# Altium schematic sheet [03] - 28Pins Schematic.SchDoc (part 2 of 3)
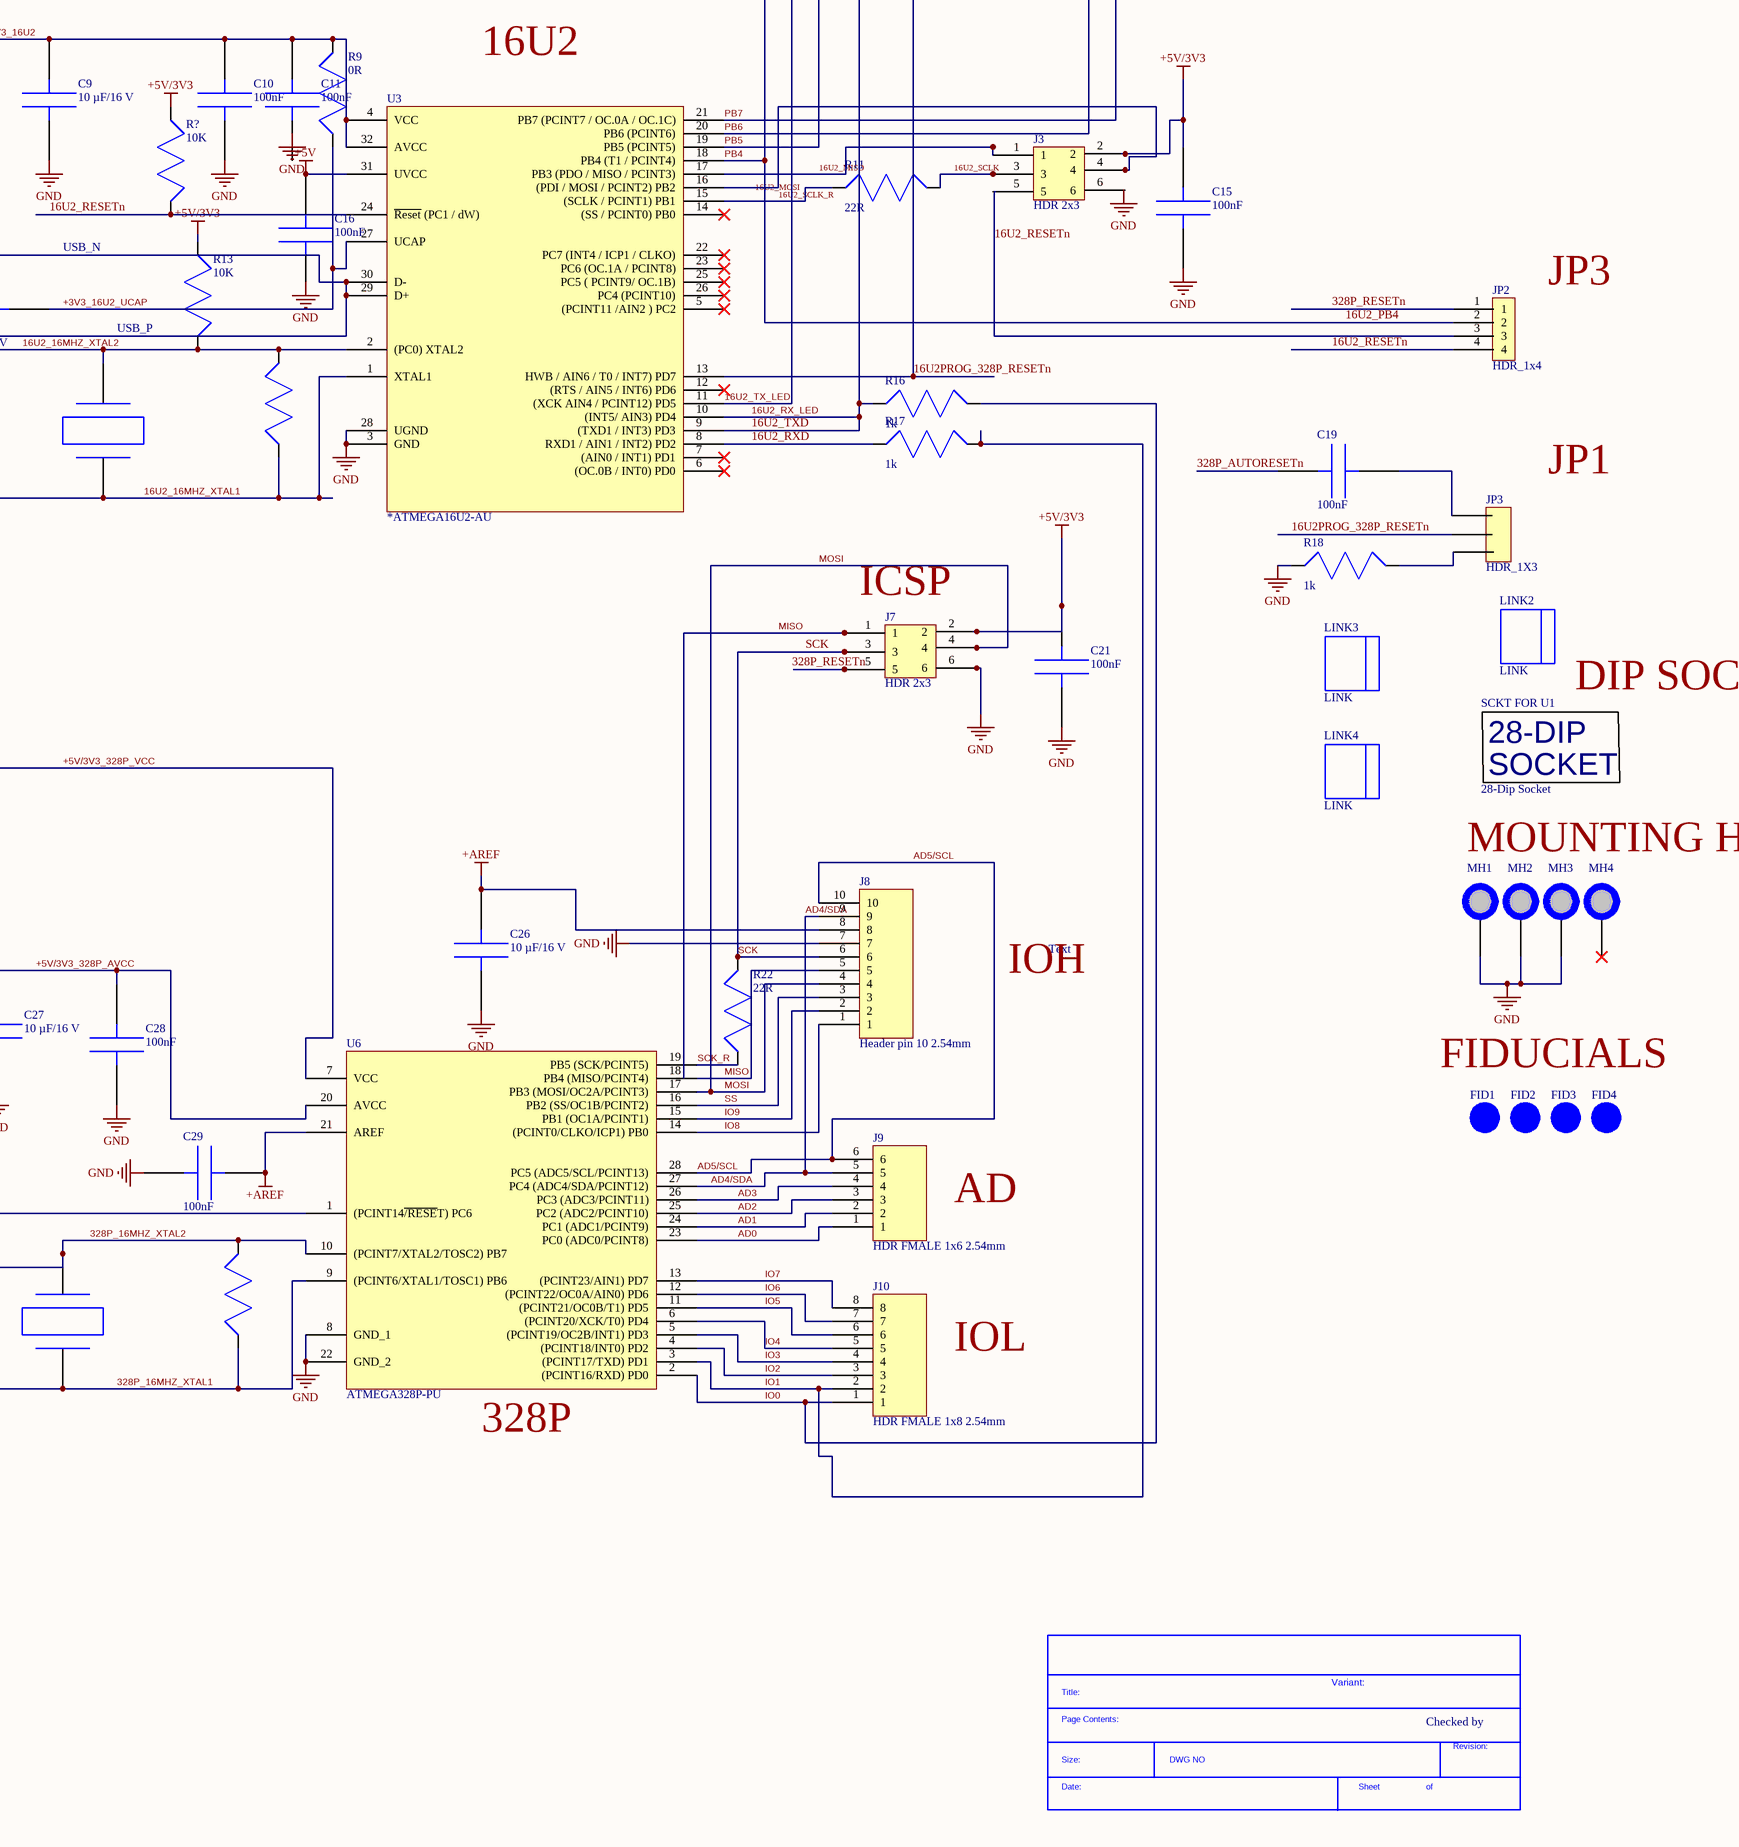
[diagram p4: [03] - 28Pins Schematic.SchDoc, bottom right]
## Library data of the parts
1 1M = R?: Res Thick Film 0805 1M Ohm 1% 0.125W(1/8W) ±100ppm/C Pad SMD T/R; Manufacturer: Yageo Phycomp; Manufacturer Part Number: RC0805FR-071ML; Power Rating: 125mW; Temperature Coefficient: 100ppm/°C; Resistance: 1MR; Voltage Rating (DC): 150V; Supplier 1: Digi-Key; Supplier Part Number 1: 311-1.00MCRCT-ND; RoHS: Yes; Category: Chip SMD Resistors; Stock 1: 588555; Pricing 1: 1=0.10000, 10=0.04200, 100=0.01690, 1000=0.00759, 2500=0.00659 (USD); Mount: Surface Mount; Case/Package: 0805; Number of Pins: 2; Min Operating Temperature: -55°C; Max Operating Temperature: 155°C; Tolerance: 1%; Packaging: Cut Tape; Length: 2mm; Width: 1.25mm; Height: 0.5mm; Depth: 1.25mm; REACH SVHC: No SVHC; Lead Free: Lead Free; ComponentLink1URL: http://www.mouser.com/ds/2/447/Yageo_08112016_RC0805-968729.pdf?src-supplier=Mouser; ComponentLink1Description: http://www.mouser.com/ds/2/447/Yageo_08112016_RC0805-968729.pdf?src-supplier=Mouser; ComponentLink2URL: http://www.farnell.com/datasheets/2167052.pdf?src-supplier=Farnell; ComponentLink2Description: http://www.farnell.com/datasheets/2167052.pdf?src-supplier=Farnell; ComponentLink3URL: http://www.yageo.com/documents/recent/PYu-RC_Group_51_RoHS_L_10.pdf?src-supplier=Digi-Key; ComponentLink3Description: http://www.yageo.com/documents/recent/PYu-RC_Group_51_RoHS_L_10.pdf?src-supplier=Digi-Key; ComponentLink4URL: http://www.farnell.com/datasheets/2167052.pdf?src-supplier=Newark; ComponentLink4Description: http://www.farnell.com/datasheets/2167052.pdf?src-supplier=Newark; ComponentLink5URL: http://www.farnell.com/datasheets/444164.pdf?src-supplier=Element14; ComponentLink5Description: http://www.farnell.com/datasheets/444164.pdf?src-supplier=Element14
C1 C2 C5-C7 C10 C11 C14-C16 C19 C21 C22 C24 C25 C28-C30 C33 = C2012X7R1H104K085AA: TDK - C2012X7R1H104K085AA - SMD Multilayer Ceramic Capacitor, 0.1 µF, 50 V, 0805 [2012 Metric], ± 10%, X7R, C Series; Voltage Rating: 50V; Supplier 1: Digi-Key; Supplier Part Number 1: 445-7534-1-ND; Manufacturer: TDK; Manufacturer Part Number: C2012X7R1H104K085AA; RoHS: Yes; Category: Ceramic Capacitors; Stock 1: 381078; Pricing 1: 1=0.15000, 10=0.10900, 50=0.06160, 100=0.05100, 500=0.03578, 1000=0.02962 (USD); Mount: Surface Mount; Case/Package: 0805; Number of Pins: 2; Case Code (Metric): 2012; Case Code (Imperial): 0805; Weight: 0.000194oz; Dielectric Material: Ceramic; Min Operating Temperature: -55°C; Max Operating Temperature: 125°C; Capacitance: 100nF; Tolerance: 10%; Dielectric: X7R; Packaging: Tape and Reel; Voltage Rating (DC): 50V; Termination: SMD/SMT; Construction: Flat; Package Quantity: 1; Resistor Type: Ceramic; Voltage: 50V; Series: C; Length: 2mm; Width: 0.049inch; Height: 0.85mm; Depth: 1.25mm; Thickness: 0.037inch; Radiation Hardening: No; RoHS Compliant: Yes; REACH SVHC: No SVHC; Lead Free: Lead Free; ComponentLink1URL: https://datasheet.ciiva.com/11788/0900766b80c1bb00-11788128.pdf?src-supplier=RSComponents; ComponentLink1Description: https://datasheet.ciiva.com/11788/0900766b80c1bb00-11788128.pdf?src-supplier=RSComponents; ComponentLink2URL: https://datasheet.ciiva.com/6250/tdkmlcccaprange-6250821.pdf?src-supplier=Digi-Key; ComponentLink2Description: https://datasheet.ciiva.com/6250/tdkmlcccaprange-6250821.pdf?src-supplier=Digi-Key; ComponentLink3URL: https://datasheet.ciiva.com/6250/tdkmlcccaprange-6250824.pdf?src-supplier=Digi-Key; ComponentLink3Description: https://datasheet.ciiva.com/6250/tdkmlcccaprange-6250824.pdf?src-supplier=Digi-Key; ComponentLink4URL: https://datasheet.ciiva.com/24191/e412-c-24191447.pdf?src-supplier=Future+Electronics; ComponentLink4Description: https://datasheet.ciiva.com/24191/e412-c-24191447.pdf?src-supplier=Future+Electronics; ComponentLink5URL: https://datasheet.ciiva.com/23803/1796654-23803035.pdf?src-supplier=Newark; ComponentLink5Description: https://datasheet.ciiva.com/23803/1796654-23803035.pdf?src-supplier=Newark; ComponentLink6URL: https://datasheet.ciiva.com/28602/1571323-28602204.pdf?src-supplier=Element14; ComponentLink6Description: https://datasheet.ciiva.com/28602/1571323-28602204.pdf?src-supplier=Element14
C3 C4 C8 C9 C23 C26 C27 = C2012X5R1C106M085AC: TDK - C2012X5R1C106M085AC - SMD Multilayer Ceramic Capacitor, 10 µF, 16 V, 0805 [2012 Metric], ± 20%, X5R, C Series TDK; Capacitance: 10uF; Voltage Rating: 16V; Supplier 1: Digi-Key; Supplier Part Number 1: 445-7645-1-ND; Manufacturer: TDK; Manufacturer Part Number: C2012X5R1C106M085AC; RoHS: Yes; Category: Ceramic Capacitors; Stock 1: 117974; Pricing 1: 1=0.29000, 10=0.19800, 50=0.11900, 100=0.10050, 500=0.06876, 1000=0.06084 (USD); Mount: Surface Mount; Case/Package: 0805; Number of Pins: 2; Case Code (Metric): 2012; Case Code (Imperial): 0805; Weight: 0.000194oz; Dielectric Material: Ceramic; Min Operating Temperature: -55°C; Max Operating Temperature: 85°C; Packaging: Tape and Reel; Tolerance: 20%; Termination: SMD/SMT; Package Quantity: 4000; Voltage Rating (DC): 16V; Dielectric: X5R; Resistor Type: Ceramic; Series: C; Construction: Flat; Voltage: 16V; Length: 2mm; Width: 0.049inch; Height: 0.85mm; Thickness: 0.037inch; Depth: 1.25mm; REACH SVHC: No SVHC; Lead Free: Lead Free; ComponentLink1URL: https://datasheet.ciiva.com/24218/c2012x5r1c106m085ac-265002-24218340.pdf?src-supplier=Mouser; ComponentLink1Description: https://datasheet.ciiva.com/24218/c2012x5r1c106m085ac-265002-24218340.pdf?src-supplier=Mouser; ComponentLink2URL: https://datasheet.ciiva.com/11788/0900766b80c1bb00-11788108.pdf?src-supplier=RSComponents; ComponentLink2Description: https://datasheet.ciiva.com/11788/0900766b80c1bb00-11788108.pdf?src-supplier=RSComponents; ComponentLink3URL: https://datasheet.ciiva.com/6290/tdkmlcccaprange-6290487.pdf?src-supplier=Digi-Key; ComponentLink3Description: https://datasheet.ciiva.com/6290/tdkmlcccaprange-6290487.pdf?src-supplier=Digi-Key; ComponentLink4URL: https://datasheet.ciiva.com/6290/tdkmlcccaprange-6290485.pdf?src-supplier=Digi-Key; ComponentLink4Description: https://datasheet.ciiva.com/6290/tdkmlcccaprange-6290485.pdf?src-supplier=Digi-Key; ComponentLink5URL: https://datasheet.ciiva.com/16449/e412-c-16449591.pdf?src-supplier=Future+Electronics; ComponentLink5Description: https://datasheet.ciiva.com/16449/e412-c-16449591.pdf?src-supplier=Future+Electronics; ComponentLink6URL: https://datasheet.ciiva.com/22725/1913358-22725557.pdf?src-supplier=Element14; ComponentLink6Description: https://datasheet.ciiva.com/22725/1913358-22725557.pdf?src-supplier=Element14; ComponentLink7URL: https://datasheet.ciiva.com/23803/1796654-23803021.pdf?src-supplier=Newark; ComponentLink7Description: https://datasheet.ciiva.com/23803/1796654-23803021.pdf?src-supplier=Newark
C12 C13 = EEE-1AA101WR: Cap Aluminum 100uF 10V 20% (5 X 5.4mm) SMD 50mA 1000 hr 85°C T/R; Manufacturer: Panasonic; Life (Hours): 1000Hour; Supplier 1: RSComponents; Supplier Part Number 1: 1763738; Manufacturer Part Number: EEE-1AA101WR; RoHS: Yes; Category: Aluminum Electrolytic Capacitors; Stock 1: 1; Pricing 1: 1000=0.08000, 3000=0.07600 (USD); Mount: Surface Mount,PCB; Case/Package: Radial; Contact Plating: Tin; Min Operating Temperature: -40°C; Max Operating Temperature: 85°C; Capacitance: 100uF; Tolerance: 20%; Ripple Current: 50mA; Voltage Rating: 10V; Packaging: Tape and Reel; Package Quantity: 1; Voltage Rating (DC): 10V; Termination: SMD/SMT; Ripple Current (AC): 50mA; Series: S; Construction: Cylindrical; Diameter: 5mm; Length: 5.5mm; Height: 5.4mm; Height - Seated (Max): 0.213inch; Radiation Hardening: No; Lead Free: Lead Free; RoHS Compliant: Yes; REACH SVHC: Unknown; ComponentLink1URL: https://datasheet.ciiva.com/26945/getdatasheetpartid-169213-26945071.pdf?src-supplier=Verical; ComponentLink1Description: https://datasheet.ciiva.com/26945/getdatasheetpartid-169213-26945071.pdf?src-supplier=Verical; ComponentLink2URL: https://datasheet.ciiva.com/24027/aba0000ce2-40801-24027541.pdf?src-supplier=Mouser; ComponentLink2Description: https://datasheet.ciiva.com/24027/aba0000ce2-40801-24027541.pdf?src-supplier=Mouser; ComponentLink3URL: https://datasheet.ciiva.com/14598/70255710-14598233.pdf?src-supplier=Allied+Electronics; ComponentLink3Description: https://datasheet.ciiva.com/14598/70255710-14598233.pdf?src-supplier=Allied+Electronics; ComponentLink4URL: https://datasheet.ciiva.com/14605/70255710-14605689.pdf?src-supplier=Allied+Electronics; ComponentLink4Description: https://datasheet.ciiva.com/14605/70255710-14605689.pdf?src-supplier=Allied+Electronics; ComponentLink5URL: https://datasheet.ciiva.com/11673/aba0000ce2-11673882.pdf?src-supplier=Avnet; ComponentLink5Description: https://datasheet.ciiva.com/11673/aba0000ce2-11673882.pdf?src-supplier=Avnet; ComponentLink6URL: https://datasheet.ciiva.com/16427/aba0000ce2-16427544.pdf?src-supplier=Future+Electronics; ComponentLink6Description: https://datasheet.ciiva.com/16427/aba0000ce2-16427544.pdf?src-supplier=Future+Electronics; ComponentLink7URL: https://datasheet.ciiva.com/2983/aba0000ce2-2983906.pdf?src-supplier=Avnet; ComponentLink7Description: https://datasheet.ciiva.com/2983/aba0000ce2-2983906.pdf?src-supplier=Avnet; ComponentLink8URL: https://datasheet.ciiva.com/30075/11aba0000ce2-30075303.pdf?src-supplier=Onlinecomponents.com; ComponentLink8Description: https://datasheet.ciiva.com/30075/11aba0000ce2-30075303.pdf?src-supplier=Onlinecomponents.com
C17 = C2012X5R1E105K125AA: TDK - C2012X5R1E105K125AA - SMD Multilayer Ceramic Capacitor, 1 µF, 25 V, 0805 [2012 Metric], ± 10%, X5R, C Series; Capacitance: 1uF; Voltage Rating: 25V; Supplier 1: Digi-Key; Supplier Part Number 1: 445-1419-1-ND; Manufacturer: TDK; Manufacturer Part Number: C2012X5R1E105K125AA; RoHS: Yes; Category: Ceramic Capacitors; Stock 1: 297; Pricing 1: 1=0.23000, 10=0.15800, 50=0.09500, 100=0.08030, 500=0.05492, 1000=0.04858 (USD); Mount: Surface Mount; Case/Package: 0805; Number of Pins: 2; Case Code (Metric): 2012; Case Code (Imperial): 0805; Dielectric Material: Ceramic; Weight: 0.000194oz; Min Operating Temperature: -55°C; Max Operating Temperature: 85°C; Tolerance: 10%; Packaging: Tape and Reel; Voltage Rating (DC): 25V; Dielectric: X5R; Termination: SMD/SMT; Construction: Flat; Package Quantity: 2000; Resistor Type: Ceramic; Voltage: 25V; Series: C; Length: 2mm; Width: 0.049inch; Height: 1.25mm; Depth: 1.25mm; Thickness: 0.057inch; Radiation Hardening: No; Lead Free: Lead Free; RoHS Compliant: Yes; REACH SVHC: No SVHC; ComponentLink1URL: https://datasheet.ciiva.com/11787/0900766b80c1bb00-11787608.pdf?src-supplier=RSComponents; ComponentLink1Description: https://datasheet.ciiva.com/11787/0900766b80c1bb00-11787608.pdf?src-supplier=RSComponents; ComponentLink2URL: https://datasheet.ciiva.com/28602/1744655-28602171.pdf?src-supplier=Element14; ComponentLink2Description: https://datasheet.ciiva.com/28602/1744655-28602171.pdf?src-supplier=Element14; ComponentLink3URL: https://datasheet.ciiva.com/15192/getdatasheetpartid-726707-15192140.pdf?src-supplier=Verical; ComponentLink3Description: https://datasheet.ciiva.com/15192/getdatasheetpartid-726707-15192140.pdf?src-supplier=Verical; ComponentLink4URL: https://datasheet.ciiva.com/16449/e412-c-16449595.pdf?src-supplier=Future+Electronics; ComponentLink4Description: https://datasheet.ciiva.com/16449/e412-c-16449595.pdf?src-supplier=Future+Electronics
C18 C20 C31 C32 = C0805C180J5GACTU: Cap Ceramic 18pF 50V C0G 5% SMD 0805 125C Paper T/R; Manufacturer: KEMET; Temperature Coefficient: 30ppm/°C; Dissipation Factor: 0.1%; Supplier 1: Digi-Key; Supplier Part Number 1: 399-C0805C180J5GAC7800CT-ND; Manufacturer Part Number: C0805C180J5GACTU; RoHS: Yes; Category: Ceramic Capacitors; Stock 1: 5035; Pricing 1: 1=0.12000, 10=0.08600, 50=0.04900, 100=0.04070, 500=0.02852, 1000=0.02361 (USD); Mount: Surface Mount,PCB; Case/Package: 0805; Number of Pins: 2; Dielectric Material: Ceramic; Case Code (Imperial): 0805; Case Code (Metric): 2012; Contact Plating: Tin,Matte; Contact Material: Tin; Min Operating Temperature: -55°C; Max Operating Temperature: 125°C; Tolerance: 5%; Capacitance: 18pF; Dielectric: C0G; Packaging: Tape and Reel; Termination: SMD/SMT; Voltage Rating (DC): 50V; Package Quantity: 1; Series: C; Construction: Flat; Voltage: 50V; Voltage Rating: 50V; Length: 2mm; Width: 1.2mm; Height: 0.78mm; Depth: 1.25mm; Lead Pitch: 0.75mm; Thickness: 0.035inch; Radiation Hardening: No; Lead Free: Lead Free; RoHS Compliant: Yes; REACH SVHC: No SVHC; ComponentLink1URL: https://datasheet.ciiva.com/22746/1769375-22746770.pdf?src-supplier=Element14; ComponentLink1Description: https://datasheet.ciiva.com/22746/1769375-22746770.pdf?src-supplier=Element14; ComponentLink2URL: https://datasheet.ciiva.com/26923/getdatasheetpartid-759702-26923980.pdf?src-supplier=Verical; ComponentLink2Description: https://datasheet.ciiva.com/26923/getdatasheetpartid-759702-26923980.pdf?src-supplier=Verical; ComponentLink3URL: https://datasheet.ciiva.com/26847/getdatasheetpartid-385668-26847862.pdf?src-supplier=Verical; ComponentLink3Description: https://datasheet.ciiva.com/26847/getdatasheetpartid-385668-26847862.pdf?src-supplier=Verical
D1 D6 = BAT54HT1G (2): Small Signal Schottky Diode, Single, 30 V, 200 Ma, 800 Mv, 600 Ma, 150 C; Manufacturer: ON Semiconductor / Fairchild; Forward Voltage: 800mV; Forward Current: 200mA; Recovery Time: 5ns; Max Repetitive Reverse Voltage (Vrrm): 30V; Peak Non-Repetitive Surge Current: 600mA; Max Reverse Current: 2uA; Power Dissipation: 200mW; Polarity: Standard; Capacitance: 10pF; Supplier 1: Digi-Key; Supplier Part Number 1: BAT54HT1GOSTR-ND; Manufacturer Part Number: BAT54HT1G; RoHS: Yes; Category: Schottky Diodes; Stock 1: 112; Pricing 1: 3000=0.04267, 6000=0.03710, 15000=0.03153, 30000=0.03063 (USD); Mount: Surface Mount; Number of Pins: 2; Contact Plating: Tin,Matte; Min Operating Temperature: -55°C; Max Operating Temperature: 150°C; Packaging: Tape and Reel; Package Quantity: 3000; Average Rectified Current: 200mA; Reverse Recovery Time: 5ns; Max Forward Surge Current (Ifsm): 600mA; Element Configuration: Single; Max Reverse Voltage (DC): 30V; Max Surge Current: 600mA; Voltage Rating (DC): 30V; Current Rating: 200mA; Output Current: 200mA; Reverse Voltage: 30V; Max Reverse Leakage Current: 2uA; Length: 1.8mm; Width: 1.35mm; Height: 1mm; Radiation Hardening: No; Lead Free: Lead Free; REACH SVHC: No SVHC; RoHS Compliant: Yes; ComponentLink1URL: https://datasheet.ciiva.com/4714/bat54ht1-d-72881-4714706.pdf?src-supplier=Mouser; ComponentLink1Description: https://datasheet.ciiva.com/4714/bat54ht1-d-72881-4714706.pdf?src-supplier=Mouser; ComponentLink2URL: https://datasheet.ciiva.com/4452/bat54ht1g-104602-4452889.pdf?src-supplier=Mouser; ComponentLink2Description: https://datasheet.ciiva.com/4452/bat54ht1g-104602-4452889.pdf?src-supplier=Mouser; ComponentLink3URL: https://datasheet.ciiva.com/30479/0900766b811a63a9-30479442.pdf?src-supplier=RSComponents; ComponentLink3Description: https://datasheet.ciiva.com/30479/0900766b811a63a9-30479442.pdf?src-supplier=RSComponents; ComponentLink4URL: https://datasheet.ciiva.com/34301/806549-34301562.pdf?src-supplier=Jameco; ComponentLink4Description: https://datasheet.ciiva.com/34301/806549-34301562.pdf?src-supplier=Jameco; ComponentLink5URL: https://datasheet.ciiva.com/1240/1747983-1240762.pdf?src-supplier=Newark; ComponentLink5Description: https://datasheet.ciiva.com/1240/1747983-1240762.pdf?src-supplier=Newark; ComponentLink6URL: https://datasheet.ciiva.com/915/bat54ht1-d-915445.pdf?src-supplier=Digi-Key; ComponentLink6Description: https://datasheet.ciiva.com/915/bat54ht1-d-915445.pdf?src-supplier=Digi-Key; ComponentLink7URL: https://datasheet.ciiva.com/915/bat54ht1-d-915444.pdf?src-supplier=Digi-Key; ComponentLink7Description: https://datasheet.ciiva.com/915/bat54ht1-d-915444.pdf?src-supplier=Digi-Key; ComponentLink8URL: https://datasheet.ciiva.com/910/bat54ht1g-910499.pdf?src-supplier=Digi-Key; ComponentLink8Description: https://datasheet.ciiva.com/910/bat54ht1g-910499.pdf?src-supplier=Digi-Key; ComponentLink9URL: https://datasheet.ciiva.com/910/bat54ht1g-910498.pdf?src-supplier=Digi-Key; ComponentLink9Description: https://datasheet.ciiva.com/910/bat54ht1g-910498.pdf?src-supplier=Digi-Key; ComponentLink10URL: https://datasheet.ciiva.com/8294/bat54ht1-d-8294645.pdf?src-supplier=Avnet; ComponentLink10Description: https://datasheet.ciiva.com/8294/bat54ht1-d-8294645.pdf?src-supplier=Avnet; ComponentLink11URL: https://datasheet.ciiva.com/910/bat54ht1g-910497.pdf?src-supplier=Digi-Key; ComponentLink11Description: https://datasheet.ciiva.com/910/bat54ht1g-910497.pdf?src-supplier=Digi-Key; ComponentLink12URL: https://datasheet.ciiva.com/8303/bat54ht1g-8303645.pdf?src-supplier=Avnet; ComponentLink12Description: https://datasheet.ciiva.com/8303/bat54ht1g-8303645.pdf?src-supplier=Avnet; ComponentLink13URL: https://datasheet.ciiva.com/915/bat54ht1-d-915443.pdf?src-supplier=Digi-Key; ComponentLink13Description: https://datasheet.ciiva.com/915/bat54ht1-d-915443.pdf?src-supplier=Digi-Key; ComponentLink14URL: https://datasheet.ciiva.com/46429/1727620-46429206.pdf?src-supplier=Element14; ComponentLink14Description: https://datasheet.ciiva.com/46429/1727620-46429206.pdf?src-supplier=Element14; ComponentLink15URL: https://datasheet.ciiva.com/1180/bat54ht1-d-1180252.pdf?src-supplier=Element14; ComponentLink15Description: https://datasheet.ciiva.com/1180/bat54ht1-d-1180252.pdf?src-supplier=Element14; ComponentLink16URL: https://datasheet.ciiva.com/1180/bat54ht1-d-1180251.pdf?src-supplier=Element14; ComponentLink16Description: https://datasheet.ciiva.com/1180/bat54ht1-d-1180251.pdf?src-supplier=Element14; ComponentLink17URL: https://datasheet.ciiva.com/17020/bat54ht1g-17020445.pdf?src-supplier=Future+Electronics; ComponentLink17Description: https://datasheet.ciiva.com/17020/bat54ht1g-17020445.pdf?src-supplier=Future+Electronics; ComponentLink18URL: https://datasheet.ciiva.com/48686/001262925-da-01-en-diode-schottky-30v-bat54ht1g-sod-323-fsc-48686266.pdf?src-supplier=Conrad; ComponentLink18Description: https://datasheet.ciiva.com/48686/001262925-da-01-en-diode-schottky-30v-bat54ht1g-sod-323-fsc-48686266.pdf?src-supplier=Conrad
D2 D3 D5 = LOL29K-H2K1-24-Z: Smartled Orange Lc; Manufacturer: Osram Opto; Lens Color: White; Forward Current: 20mA; Forward Voltage: 2.2V; Luminous Intensity: 9mcd; Viewing Angle: 160°; Lens Style: Flat,Diffused,Colorless,Rectangular; Test Current: 2mA; Dominant Wavelength: 606nm; Luminous Flux: 0.025lm; Number of LEDs: 1; Reverse Voltage: 12V; Lens Transparency: Diffused; Lens Size: 0.8mm; Supplier 1: Arrow Electronics; Supplier Part Number 1: LO L29K-H2K1-24-Z; Manufacturer Part Number: LOL29K-H2K1-24-Z; RoHS: Yes; Category: Uncategorized; Mount: Surface Mount; Case/Package: 0603; Number of Pins: 2; Color: Orange; Case Code (Metric): 1608; Case Code (Imperial): 0603; Min Operating Temperature: -40°C; Max Operating Temperature: 100°C; Packaging: Tape and Reel; Number of Elements: 1; Series: SmartLED; Illumination Color: Orange; Package Quantity: 5000; Length: 1.3mm; Width: 0.8mm; Height: 0.65mm; Depth: 0.8mm; Radiation Hardening: No; RoHS Compliant: Yes; ComponentLink1URL: https://datasheet.ciiva.com/2112/00077105-0-2112905.pdf?src-supplier=Digi-Key; ComponentLink1Description: https://datasheet.ciiva.com/2112/00077105-0-2112905.pdf?src-supplier=Digi-Key; ComponentLink2URL: https://datasheet.ciiva.com/2112/00077105-0-2112904.pdf?src-supplier=Digi-Key; ComponentLink2Description: https://datasheet.ciiva.com/2112/00077105-0-2112904.pdf?src-supplier=Digi-Key; ComponentLink3URL: https://datasheet.ciiva.com/2112/00077105-0-2112906.pdf?src-supplier=Digi-Key; ComponentLink3Description: https://datasheet.ciiva.com/2112/00077105-0-2112906.pdf?src-supplier=Digi-Key; ComponentLink4URL: https://datasheet.ciiva.com/15198/getdatasheetpartid-693885-15198412.pdf?src-supplier=Verical; ComponentLink4Description: https://datasheet.ciiva.com/15198/getdatasheetpartid-693885-15198412.pdf?src-supplier=Verical
D4 = LGL29K-G2J1-24-Z: LED Single Chip Green 570nm 20mA 2-Pin 0603 T/R; Manufacturer: Osram Opto; Lens Color: White; Forward Voltage: 2.2V; Luminous Intensity: 5.6mcd; Viewing Angle: 160°; Lens Style: Flat,Diffused,Colorless,Rectangular; Test Current: 2mA; Luminous Flux: 0.012lm; Number of LEDs: 1; Reverse Voltage: 12V; Lens Transparency: Diffused; Lens Size: 0.8mm; Supplier 1: Bison Technologies; Supplier Part Number 1: LGL29K-G2J1-24-Z-299157-OSRAMOPTO; Manufacturer Part Number: LGL29K-G2J1-24-Z; RoHS: Yes; Category: LEDs; Stock 1: 60000; Mount: Surface Mount; Case/Package: 0603; Number of Pins: 2; Color: Green; Case Code (Metric): 1608; Case Code (Imperial): 0603; Min Operating Temperature: -40°C; Max Operating Temperature: 100°C; Forward Current: 20mA; Packaging: Tape and Reel; Dominant Wavelength: 570nm; Number of Elements: 1; Series: SmartLED; Illumination Color: Green; Package Quantity: 5000; Length: 1.3mm; Width: 0.8mm; Height: 0.65mm; Depth: 0.8mm; Radiation Hardening: No; RoHS Compliant: Yes; ComponentLink1URL: https://datasheet.ciiva.com/4689/g-l29k-39844-4689584.pdf?src-supplier=Mouser; ComponentLink1Description: https://datasheet.ciiva.com/4689/g-l29k-39844-4689584.pdf?src-supplier=Mouser; ComponentLink2URL: https://datasheet.ciiva.com/15198/getdatasheetpartid-571127-15198411.pdf?src-supplier=Verical; ComponentLink2Description: https://datasheet.ciiva.com/15198/getdatasheetpartid-571127-15198411.pdf?src-supplier=Verical; ComponentLink3URL: https://datasheet.ciiva.com/2112/00077107-0-2112887.pdf?src-supplier=Digi-Key; ComponentLink3Description: https://datasheet.ciiva.com/2112/00077107-0-2112887.pdf?src-supplier=Digi-Key; ComponentLink4URL: https://datasheet.ciiva.com/2112/00077107-0-2112886.pdf?src-supplier=Digi-Key; ComponentLink4Description: https://datasheet.ciiva.com/2112/00077107-0-2112886.pdf?src-supplier=Digi-Key; ComponentLink5URL: https://datasheet.ciiva.com/2112/00077107-0-2112888.pdf?src-supplier=Digi-Key; ComponentLink5Description: https://datasheet.ciiva.com/2112/00077107-0-2112888.pdf?src-supplier=Digi-Key
Fb1-Fb3 = MPZ2012S601AT000: Ferrite Beads Multi-Layer Power 600Ohm 25% 100MHz 2A 100mOhm DCR 0805 T/R; Manufacturer: TDK; Impedance: 600R; DC Resistance (DCR): 100mR; Supplier 1: Mouser; Supplier Part Number 1: 810-MPZ2012S601AT000; Manufacturer Part Number: MPZ2012S601AT000; RoHS: Yes; Category: Ferrite Beads and Chips; Stock 1: 2; Pricing 1: 1=0.12000, 10=0.08000, 50=0.08000, 100=0.04800, 500=0.04100, 1000=0.03500, 4000=0.03000, 8000=0.02300, 10000=0.02300 (USD); Mount: Surface Mount; Case/Package: 0805; Case Code (Metric): 2012; Case Code (Imperial): 0805; Packaging: Tape and Reel; Package Quantity: 1; Current Rating: 2A; Max DC Current: 2A; Series: MPZ; Length: 0.079inch; Width: 0.049inch; Height: 0.041inch; REACH SVHC: No SVHC; Lead Free: Lead Free; RoHS Compliant: Yes; ComponentLink1URL: https://datasheet.ciiva.com/46634/beads-commercial-power-mpz-en-46634335.pdf?src-supplier=Digi-Key; ComponentLink1Description: https://datasheet.ciiva.com/46634/beads-commercial-power-mpz-en-46634335.pdf?src-supplier=Digi-Key; ComponentLink2URL: https://datasheet.ciiva.com/46634/beads-commercial-power-mpz-en-46634377.pdf?src-supplier=Digi-Key; ComponentLink2Description: https://datasheet.ciiva.com/46634/beads-commercial-power-mpz-en-46634377.pdf?src-supplier=Digi-Key; ComponentLink3URL: https://datasheet.ciiva.com/46634/beads-commercial-power-mpz-en-46634606.pdf?src-supplier=Digi-Key; ComponentLink3Description: https://datasheet.ciiva.com/46634/beads-commercial-power-mpz-en-46634606.pdf?src-supplier=Digi-Key
FID1-FID4 = FID_1MMC: Fiducial 40mil Diameter, 120mil Mask
J1 J10 = M20-7890842: 08-WAY SIL HORIZ SOCKET L/FREE; Manufacturer: Harwin; Number of Contacts: 8; Connector Type: Receptacle; Gender: Female; Supplier 1: Digi-Key; Supplier Part Number 1: 952-1821-ND; Manufacturer Part Number: M20-7890842; RoHS: Yes; Category: Headers and Wire Housings; Stock 1: 264; Pricing 1: 1=1.61000, 29=1.34207, 87=1.25241, 464=1.04371, 957=0.89460, 4901=0.79520 (USD); Mount: Through Hole; Case/Package: SIL; Contact Plating: Gold,Tin; Color: Black; Number of Rows: 1; Termination: Solder; Package Quantity: 29; Packaging: Rail/Tube; Contact Gender: Female; Number of Positions: 8; Series: M20; Contact Type: Female Socket; Pitch: 2.54mm; RoHS Compliant: Yes; ComponentLink1URL: http://www.mouser.com/ds/2/181/M20-789-350757.pdf?src-supplier=Mouser; ComponentLink1Description: http://www.mouser.com/ds/2/181/M20-789-350757.pdf?src-supplier=Mouser; ComponentLink2URL: https://cdn.harwin.com/pdfs/M20-789.pdf?src-supplier=Digi-Key; ComponentLink2Description: https://cdn.harwin.com/pdfs/M20-789.pdf?src-supplier=Digi-Key; ComponentLink3URL: https://cdn.harwin.com/pdfs/60page142.pdf?src-supplier=Avnet+Europe; ComponentLink3Description: https://cdn.harwin.com/pdfs/60page142.pdf?src-supplier=Avnet+Europe
J2 = 68602-204HLF: Conn Unshrouded Header HDR 4 POS 2.54mm Solder ST Top Entry Thru-Hole BergStik® Bulk; Manufacturer: Amphenol ICC / FCI; Supplier 1: Digi-Key; Supplier Part Number 1: 609-3369-ND; Manufacturer Part Number: 68602-204HLF; RoHS: No; Category: Connectors; Stock 1: 45; Pricing 1: 1=0.35000, 10=0.30100 (USD); ComponentLink1URL: https://cdn.amphenol-icc.com/media/wysiwyg/files/drawing/67996.pdf?src-supplier=Mouser; ComponentLink1Description: https://cdn.amphenol-icc.com/media/wysiwyg/files/drawing/67996.pdf?src-supplier=Mouser; ComponentLink2URL: https://cdn.amphenol-icc.com/media/wysiwyg/files/drawing/67996.pdf?src-supplier=Avnet; ComponentLink2Description: https://cdn.amphenol-icc.com/media/wysiwyg/files/drawing/67996.pdf?src-supplier=Avnet; ComponentLink3URL: https://cdn.amphenol-icc.com/media/wysiwyg/files/drawing/67996.pdf?src-supplier=Allied+Electronics; ComponentLink3Description: https://cdn.amphenol-icc.com/media/wysiwyg/files/drawing/67996.pdf?src-supplier=Allied+Electronics; ComponentLink4URL: https://cdn.amphenol-icc.com/media/wysiwyg/files/drawing/67996.pdf?src-supplier=Digi-Key; ComponentLink4Description: https://cdn.amphenol-icc.com/media/wysiwyg/files/drawing/67996.pdf?src-supplier=Digi-Key; ComponentLink5URL: https://cdn.amphenol-icc.com/media/wysiwyg/files/drawing/67996.pdf?src-supplier=Heilind+Electronics; ComponentLink5Description: https://cdn.amphenol-icc.com/media/wysiwyg/files/drawing/67996.pdf?src-supplier=Heilind+Electronics
J3 J7 = 67997-106HLF: Conn Unshrouded Header HDR 6 POS 2.54mm Solder ST Top Entry Thru-Hole BergStik® Bulk; Manufacturer: Amphenol ICC / FCI; Supplier 1: Digi-Key; Supplier Part Number 1: 609-3393-ND; Manufacturer Part Number: 67997-106HLF; RoHS: No; Category: Headers and Wire Housings; Stock 1: 696; Pricing 1: 1=2.18000, 10=1.90000, 100=1.69810, 500=1.41506, 1000=1.21291, 5000=1.07814 (USD); ComponentLink1URL: http://components.arrow.com/part/dataview/0323_00898189?src-supplier=Arrow+Europe; ComponentLink1Description: http://components.arrow.com/part/dataview/0323_00898189?src-supplier=Arrow+Europe; ComponentLink2URL: http://uk.rs-online.com/webdocs/1450/0900766b81450b8b.pdf?src-supplier=RSComponents; ComponentLink2Description: http://uk.rs-online.com/webdocs/1450/0900766b81450b8b.pdf?src-supplier=RSComponents; ComponentLink3URL: http://www.farnell.com/datasheets/1876884.pdf?src-supplier=Newark; ComponentLink3Description: http://www.farnell.com/datasheets/1876884.pdf?src-supplier=Newark; ComponentLink4URL: http://www.farnell.com/datasheets/1876884.pdf?src-supplier=Farnell; ComponentLink4Description: http://www.farnell.com/datasheets/1876884.pdf?src-supplier=Farnell; ComponentLink5URL: https://cdn.amphenol-icc.com/media/wysiwyg/files/drawing/67996.pdf?src-supplier=Digi-Key; ComponentLink5Description: https://cdn.amphenol-icc.com/media/wysiwyg/files/drawing/67996.pdf?src-supplier=Digi-Key; ComponentLink6URL: https://cdn.amphenol-icc.com/media/wysiwyg/files/drawing/67996.pdf?src-supplier=Mouser; ComponentLink6Description: https://cdn.amphenol-icc.com/media/wysiwyg/files/drawing/67996.pdf?src-supplier=Mouser; ComponentLink7URL: https://cdn.amphenol-icc.com/media/wysiwyg/files/drawing/67996.pdf?src-supplier=Avnet; ComponentLink7Description: https://cdn.amphenol-icc.com/media/wysiwyg/files/drawing/67996.pdf?src-supplier=Avnet; ComponentLink8URL: http://components.arrow.com/part/dataview/41913658S7633350N8314?src-supplier=Arrow+Electronics; ComponentLink8Description: http://components.arrow.com/part/dataview/41913658S7633350N8314?src-supplier=Arrow+Electronics; ComponentLink9URL: https://cdn.amphenol-icc.com/media/wysiwyg/files/drawing/67996.pdf?src-supplier=Onlinecomponents.com; ComponentLink9Description: https://cdn.amphenol-icc.com/media/wysiwyg/files/drawing/67996.pdf?src-supplier=Onlinecomponents.com; ComponentLink10URL: https://cdn.amphenol-icc.com/media/wysiwyg/files/drawing/67996.pdf?src-supplier=Avnet+Europe; ComponentLink10Description: https://cdn.amphenol-icc.com/media/wysiwyg/files/drawing/67996.pdf?src-supplier=Avnet+Europe; ComponentLink11URL: https://cdn.amphenol-icc.com/media/wysiwyg/files/drawing/67996.pdf?src-supplier=Avnet+Asia; ComponentLink11Description: https://cdn.amphenol-icc.com/media/wysiwyg/files/drawing/67996.pdf?src-supplier=Avnet+Asia; ComponentLink12URL: https://cdn.amphenol-icc.com/media/wysiwyg/files/drawing/67996.pdf?src-supplier=Allied+Electronics; ComponentLink12Description: https://cdn.amphenol-icc.com/media/wysiwyg/files/drawing/67996.pdf?src-supplier=Allied+Electronics; ComponentLink13URL: https://cdn.amphenol-icc.com/media/wysiwyg/files/drawing/67996.pdf?src-supplier=TTI; ComponentLink13Description: https://cdn.amphenol-icc.com/media/wysiwyg/files/drawing/67996.pdf?src-supplier=TTI; ComponentLink14URL: https://cdn.amphenol-icc.com/media/wysiwyg/files/drawing/67996.pdf?src-supplier=Heilind+Electronics; ComponentLink14Description: https://cdn.amphenol-icc.com/media/wysiwyg/files/drawing/67996.pdf?src-supplier=Heilind+Electronics
J4 = 10118193-0001LF: FCI Right Angle Surface Mount Mount Female USB Connector; 100 V ac; 1.8A; Manufacturer: Amphenol ICC / FCI; Supplier 1: Digi-Key; Supplier Part Number 1: 609-4616-2-ND; Manufacturer Part Number: 10118193-0001LF; RoHS: No; Category: USB Connectors; Stock 1: 124683; Pricing 1: 1200=0.24862, 2400=0.22601, 6000=0.21848, 8400=0.20341, 12000=0.20090 (USD); ComponentLink1URL: http://components.arrow.com/part/dataview/0323_04107372?src-supplier=Arrow+Europe; ComponentLink1Description: http://components.arrow.com/part/dataview/0323_04107372?src-supplier=Arrow+Europe; ComponentLink2URL: http://uk.rs-online.com/webdocs/1450/0900766b814507f1.pdf?src-supplier=RSComponents; ComponentLink2Description: http://uk.rs-online.com/webdocs/1450/0900766b814507f1.pdf?src-supplier=RSComponents; ComponentLink3URL: https://cdn.amphenol-icc.com/media/wysiwyg/files/documentation/datasheet/inputoutput/io_usb_micro.pdf?src-supplier=Avnet; ComponentLink3Description: https://cdn.amphenol-icc.com/media/wysiwyg/files/documentation/datasheet/inputoutput/io_usb_micro.pdf?src-supplier=Avnet; ComponentLink4URL: https://cdn.amphenol-icc.com/media/wysiwyg/files/documentation/datasheet/inputoutput/io_usb_micro.pdf?src-supplier=Arrow+Electronics; ComponentLink4Description: https://cdn.amphenol-icc.com/media/wysiwyg/files/documentation/datasheet/inputoutput/io_usb_micro.pdf?src-supplier=Arrow+Electronics; ComponentLink5URL: https://cdn.amphenol-icc.com/media/wysiwyg/files/documentation/datasheet/inputoutput/io_usb_micro.pdf?src-supplier=Onlinecomponents.com; ComponentLink5Description: https://cdn.amphenol-icc.com/media/wysiwyg/files/documentation/datasheet/inputoutput/io_usb_micro.pdf?src-supplier=Onlinecomponents.com; ComponentLink6URL: https://cdn.amphenol-icc.com/media/wysiwyg/files/documentation/datasheet/inputoutput/io_usb_micro.pdf?src-supplier=Verical; ComponentLink6Description: https://cdn.amphenol-icc.com/media/wysiwyg/files/documentation/datasheet/inputoutput/io_usb_micro.pdf?src-supplier=Verical; ComponentLink7URL: http://www.amphenol-icc.com/media/wysiwyg/files/drawing/10118193.pdf?src-supplier=Digi-Key; ComponentLink7Description: http://www.amphenol-icc.com/media/wysiwyg/files/drawing/10118193.pdf?src-supplier=Digi-Key; ComponentLink8URL: https://cdn.amphenol-icc.com/media/wysiwyg/files/documentation/datasheet/inputoutput/io_usb_micro.pdf?src-supplier=Digi-Key; ComponentLink8Description: https://cdn.amphenol-icc.com/media/wysiwyg/files/documentation/datasheet/inputoutput/io_usb_micro.pdf?src-supplier=Digi-Key; ComponentLink9URL: https://cdn.amphenol-icc.com/media/wysiwyg/files/documentation/datasheet/inputoutput/io_usb_micro.pdf?src-supplier=Mouser; ComponentLink9Description: https://cdn.amphenol-icc.com/media/wysiwyg/files/documentation/datasheet/inputoutput/io_usb_micro.pdf?src-supplier=Mouser; ComponentLink10URL: https://cdn.amphenol-icc.com/media/wysiwyg/files/documentation/datasheet/inputoutput/io_usb_micro.pdf?src-supplier=Allied+Electronics; ComponentLink10Description: https://cdn.amphenol-icc.com/media/wysiwyg/files/documentation/datasheet/inputoutput/io_usb_micro.pdf?src-supplier=Allied+Electronics; ComponentLink11URL: https://cdn.amphenol-icc.com/media/wysiwyg/files/documentation/datasheet/inputoutput/io_usb_micro.pdf?src-supplier=RSComponents; ComponentLink11Description: https://cdn.amphenol-icc.com/media/wysiwyg/files/documentation/datasheet/inputoutput/io_usb_micro.pdf?src-supplier=RSComponents; ComponentLink12URL: https://cdn.amphenol-icc.com/media/wysiwyg/files/documentation/datasheet/inputoutput/io_usb_micro.pdf?src-supplier=TTI; ComponentLink12Description: https://cdn.amphenol-icc.com/media/wysiwyg/files/documentation/datasheet/inputoutput/io_usb_micro.pdf?src-supplier=TTI; ComponentLink13URL: https://cdn.amphenol-icc.com/media/wysiwyg/files/documentation/datasheet/inputoutput/io_usb_micro.pdf?src-supplier=TME; ComponentLink13Description: https://cdn.amphenol-icc.com/media/wysiwyg/files/documentation/datasheet/inputoutput/io_usb_micro.pdf?src-supplier=TME; ComponentLink14URL: https://cdn.amphenol-icc.com/media/wysiwyg/files/documentation/datasheet/inputoutput/io_usb_micro.pdf?src-supplier=Heilind+Electronics; ComponentLink14Description: https://cdn.amphenol-icc.com/media/wysiwyg/files/documentation/datasheet/inputoutput/io_usb_micro.pdf?src-supplier=Heilind+Electronics
J5 J6 = PAD_WITH_HOLE_4MMx1.5MM: Pad with a hole 4mm x 1.5mm
J8 = M20-7821046: HARWIN - M20-7821046 - Board-To-Board Connector, M20 Series, Through Hole, Receptacle, 10, 2.54 mm, Tin Plated Contacts; Number of Contacts: 10; Max Current Rating: 3A; Contact Resistance: 20mR; Mating Cycles: 50; Insulation Resistance: 1MR; Hole Diameter: 0.8mm; Supplier 1: Digi-Key; Supplier Part Number 1: 952-1847-ND; Manufacturer: Harwin; Manufacturer Part Number: M20-7821046; RoHS: Yes; Category: Headers and Wire Housings; Stock 1: 628; Pricing 1: 1=1.34000, 22=1.13182, 88=1.01636, 440=0.83159, 946=0.73920, 4906=0.64680, 9812=0.61600 (USD); Mount: Through Hole; Case/Package: SIL; Color: Black; Contact Plating: Tin; Contact Material: Bronze; Housing Color: Black; Housing Material: Polyamide; Min Operating Temperature: -40°C; Max Operating Temperature: 105°C; Number of Rows: 1; Termination: Solder; Packaging: Rail/Tube; Contact Gender: Female; Package Quantity: 23; Current Rating: 3A; Connector Type: Receptacle; Number of Positions: 10; Gender: Receptacle; Orientation: Straight; Series: M20; Contact Type: Female Socket; Length: 25.8mm; Pitch: 2.54mm; Lead Pitch: 2.54mm; Depth: 2.5mm; Radiation Hardening: No; REACH SVHC: No SVHC; ComponentLink1URL: https://datasheet.ciiva.com/11753/0900766b80dc1d2b-11753869.pdf?src-supplier=RSComponents; ComponentLink1Description: https://datasheet.ciiva.com/11753/0900766b80dc1d2b-11753869.pdf?src-supplier=RSComponents; ComponentLink2URL: https://datasheet.ciiva.com/26899/getdatasheetpartid-559226-26899379.pdf?src-supplier=Verical; ComponentLink2Description: https://datasheet.ciiva.com/26899/getdatasheetpartid-559226-26899379.pdf?src-supplier=Verical; ComponentLink3URL: https://datasheet.ciiva.com/10151/m20-782-10151366.pdf?src-supplier=Avnet; ComponentLink3Description: https://datasheet.ciiva.com/10151/m20-782-10151366.pdf?src-supplier=Avnet; ComponentLink4URL: https://datasheet.ciiva.com/6785/m20-782-6785605.pdf?src-supplier=Digi-Key; ComponentLink4Description: https://datasheet.ciiva.com/6785/m20-782-6785605.pdf?src-supplier=Digi-Key; ComponentLink5URL: https://datasheet.ciiva.com/16732/m20-782-16732152.pdf?src-supplier=Avnet+Europe; ComponentLink5Description: https://datasheet.ciiva.com/16732/m20-782-16732152.pdf?src-supplier=Avnet+Europe
J9 = M20-7820646: 06-WAY SIL VERT SOCKET L/FREE; Manufacturer: Harwin; Number of Contacts: 6; Max Current Rating: 3A; Contact Resistance: 20mR; Connector Type: Receptacle; Gender: Female; Supplier 1: Digi-Key; Supplier Part Number 1: 952-1809-ND; Manufacturer Part Number: M20-7820646; RoHS: Yes; Category: Headers and Wire Housings; Stock 1: 323; Pricing 1: 1=1.06000, 36=0.86111, 108=0.80620, 468=0.65962, 972=0.58632, 4932=0.51303, 9828=0.48860 (USD); Mount: Through Hole; Case/Package: SIL; Color: Black; Contact Plating: Tin; Contact Material: Bronze; Housing Color: Black; Housing Material: Nylon; Min Operating Temperature: -40°C; Max Operating Temperature: 105°C; Number of Rows: 1; Termination: Solder; Packaging: Rail/Tube; Contact Gender: Female; Package Quantity: 38; Number of Positions: 6; Orientation: Straight; Series: M20; Contact Type: Female Socket; Length: 15.64mm; Pitch: 2.54mm; Depth: 2.5mm; Radiation Hardening: No; RoHS Compliant: Yes; ComponentLink1URL: http://components.arrow.com/part/dataview/0323_00725884?src-supplier=Arrow+Europe; ComponentLink1Description: http://components.arrow.com/part/dataview/0323_00725884?src-supplier=Arrow+Europe; ComponentLink2URL: https://cdn.harwin.com/pdfs/M20-782.pdf?src-supplier=Farnell; ComponentLink2Description: https://cdn.harwin.com/pdfs/M20-782.pdf?src-supplier=Farnell; ComponentLink3URL: http://www.harwin.com/include/downloads/pdfs/2010PAGE120.PDF?src-supplier=Avnet; ComponentLink3Description: http://www.harwin.com/include/downloads/pdfs/2010PAGE120.PDF?src-supplier=Avnet; ComponentLink4URL: https://cdn.harwin.com/pdfs/M20-782.pdf?src-supplier=Digi-Key; ComponentLink4Description: https://cdn.harwin.com/pdfs/M20-782.pdf?src-supplier=Digi-Key; ComponentLink5URL: https://cdn.harwin.com/pdfs/Harwin_PC_Connectors_M20.pdf?src-supplier=Mouser; ComponentLink5Description: https://cdn.harwin.com/pdfs/Harwin_PC_Connectors_M20.pdf?src-supplier=Mouser; ComponentLink6URL: https://cdn.harwin.com/pdfs/Harwin_PC_Connectors_M20.pdf?src-supplier=Avnet+Europe; ComponentLink6Description: https://cdn.harwin.com/pdfs/Harwin_PC_Connectors_M20.pdf?src-supplier=Avnet+Europe; ComponentLink7URL: https://cdn.harwin.com/pdfs/Harwin_PC_Connectors_M20.pdf?src-supplier=RSComponents; ComponentLink7Description: https://cdn.harwin.com/pdfs/Harwin_PC_Connectors_M20.pdf?src-supplier=RSComponents; ComponentLink8URL: https://cdn.harwin.com/pdfs/M20-782.pdf?src-supplier=Newark; ComponentLink8Description: https://cdn.harwin.com/pdfs/M20-782.pdf?src-supplier=Newark; ComponentLink9URL: https://cdn.harwin.com/pdfs/Harwin_PC_Connectors_M20.pdf?src-supplier=TTI; ComponentLink9Description: https://cdn.harwin.com/pdfs/Harwin_PC_Connectors_M20.pdf?src-supplier=TTI
JP1 JP3 = 68000-103HLF: Conn Unshrouded Header HDR 3 POS 2.54mm Solder ST Top Entry Thru-Hole BergStik® Automotive Bulk; Manufacturer: Amphenol ICC; Supplier 1: Allied Electronics; Supplier Part Number 1: 70236888; Manufacturer Part Number: 68000-103HLF; RoHS: Yes; Category: Headers and Wire Housings; RoHS Compliant: Yes; ComponentLink1URL: http://www.farnell.com/cad/1914865.pdf?src-supplier=Farnell; ComponentLink1Description: http://www.farnell.com/cad/1914865.pdf?src-supplier=Farnell; ComponentLink2URL: http://www.farnell.com/cad/1914865.pdf?src-supplier=Element14; ComponentLink2Description: http://www.farnell.com/cad/1914865.pdf?src-supplier=Element14; ComponentLink3URL: http://www.farnell.com/cad/1914865.pdf?src-supplier=Newark; ComponentLink3Description: http://www.farnell.com/cad/1914865.pdf?src-supplier=Newark; ComponentLink4URL: https://cdn.amphenol-icc.com/media/wysiwyg/files/drawing/68000.pdf?src-supplier=Digi-Key; ComponentLink4Description: https://cdn.amphenol-icc.com/media/wysiwyg/files/drawing/68000.pdf?src-supplier=Digi-Key
JP2 = 68001-204HLF: Conn Unshrouded Header HDR 4 POS 2.54mm Solder ST Thru-Hole Bag; Manufacturer: Amphenol ICC; Supplier 1: Allied Electronics; Supplier Part Number 1: 70302499; Manufacturer Part Number: 68001-204HLF; RoHS: Yes; Category: Headers and Wire Housings; ComponentLink1URL: http://www.farnell.com/cad/2615197.pdf?src-supplier=Farnell; ComponentLink1Description: http://www.farnell.com/cad/2615197.pdf?src-supplier=Farnell; ComponentLink2URL: http://www.farnell.com/cad/2615197.pdf?src-supplier=Newark; ComponentLink2Description: http://www.farnell.com/cad/2615197.pdf?src-supplier=Newark
L1 = L1210R2R2MDWIT: Inductor RF Chip Wirewound 2.2uH 20% 100KHz 1.13A 0.104Ohm DCR 1210 T/R; Manufacturer: KEMET; Core Material: Ferrite; Max DC Current: 2A; Shielding: Unshielded; Self Resonant Frequency: 190MHz; DC Resistance (DCR): 80mR; Supplier 1: Digi-Key; Supplier Part Number 1: 399-9598-1-ND; Manufacturer Part Number: L1210R2R2MDWIT; RoHS: Yes; Category: Fixed Inductors; Stock 1: 13928; Pricing 1: 1=0.50000, 10=0.43700, 25=0.40600, 50=0.34360, 100=0.31240, 250=0.29364, 500=0.26240 (USD); Mount: Surface Mount; Case/Package: 1210; Case Code (Metric): 3225; Case Code (Imperial): 1210; Min Operating Temperature: -40°C; Max Operating Temperature: 105°C; Tolerance: 20%; Inductance: 2.2uH; Package Quantity: 1000; Current Rating: 2A; Packaging: Tape and Reel; Inductance Tolerance: 20%; Resistor Type: Wirewound,Ceramic; Test Frequency: 100kHz; Termination: SMD/SMT; DC Current: 1.13A; Series: L-DWI; Length: 0.126inch; Width: 0.098inch; Height: 2.5mm; Height - Seated (Max): 0.106inch; Depth: 2.7mm; Radiation Hardening: No; REACH SVHC: No SVHC; Military Standard: Not; RoHS Compliant: Yes; ComponentLink1URL: https://datasheet.ciiva.com/8512/f3115-8512543.pdf?src-supplier=Avnet; ComponentLink1Description: https://datasheet.ciiva.com/8512/f3115-8512543.pdf?src-supplier=Avnet; ComponentLink2URL: https://datasheet.ciiva.com/6691/f3115-6691487.pdf?src-supplier=Digi-Key; ComponentLink2Description: https://datasheet.ciiva.com/6691/f3115-6691487.pdf?src-supplier=Digi-Key; ComponentLink3URL: https://datasheet.ciiva.com/4957/f3115-4957838.pdf?src-supplier=Mouser; ComponentLink3Description: https://datasheet.ciiva.com/4957/f3115-4957838.pdf?src-supplier=Mouser; ComponentLink4URL: https://datasheet.ciiva.com/17280/f3115-17280270.pdf?src-supplier=Avnet+Europe; ComponentLink4Description: https://datasheet.ciiva.com/17280/f3115-17280270.pdf?src-supplier=Avnet+Europe; ComponentLink5URL: https://datasheet.ciiva.com/22685/27262-22685038.pdf?src-supplier=Element14; ComponentLink5Description: https://datasheet.ciiva.com/22685/27262-22685038.pdf?src-supplier=Element14
LINK1-LINK4 = QPC02SXGN-RC: 2 Position 2.54 mm Centerline Single Circuit Open Top Jumper; Manufacturer: Sullins; Number of Positions: 2; Pitch: 0.1inch; Supplier 1: Digi-Key; Supplier Part Number 1: S9337-ND; Manufacturer Part Number: QPC02SXGN-RC; RoHS: Yes; Category: Connectors; Stock 1: 943759; Pricing 1: 1=0.10000, 10=0.05000, 25=0.04080, 50=0.03780, 100=0.03650, 250=0.03152, 500=0.03024, 1000=0.02646, 2500=0.02394 (USD); Case/Package: 100; Contact Plating: Gold; Package Quantity: 2000; Packaging: Bulk; Height: 0.235inch; Lead Free: Lead Free; ComponentLink1URL: https://datasheet.ciiva.com/767/284-sxgn-11510-767869.pdf?src-supplier=Digi-Key; ComponentLink1Description: https://datasheet.ciiva.com/767/284-sxgn-11510-767869.pdf?src-supplier=Digi-Key
MH1-MH3 = MH_7.4MMNC_3.2MMD: Hole 7.4mm Diameter (Non Copper), 3.2mm Drill NPTH
MH4 = MH_7.4MMC_3.2MMD: Mounting Hole 7.4mm Diameter, 3.2mm Drill
R1 R13 R19 R23-R25 R? = RC0805FR-0710KL: Res SMD 0805 10K 1% 0.125W T.C.100PPM; Manufacturer: Yageo; Resistance: 10kR; Temperature Coefficient: 100ppm/°C; Power Rating: 125mW; Voltage Rating: 150V; Supplier 1: Digi-Key; Supplier Part Number 1: 311-10.0KCRTR-ND; Manufacturer Part Number: RC0805FR-0710KL; RoHS: Yes; Category: Chip SMD Resistors; Stock 1: 2265398; Pricing 1: 5000=0.00544 (USD); Case/Package: 0805; Case Code (Imperial): 0805; Case Code (Metric): 2012; Size Code: 0805; Min Operating Temperature: -55°C; Max Operating Temperature: 155°C; Tolerance: 1%; Resistor Type: Thick Film; Packaging: Tape and Reel; Package Quantity: 1; Termination: SMD/SMT; Number of Terminations: 2; Max Power Dissipation: 125mW; Features: Moisture Resistant; Series: RC; Construction: Rectangular; Resistance Tolerance: 1%; Technology: THICK FILM; Length: 2mm; Width: 0.049inch; Height: 0.024inch; Depth: 1.25mm; REACH SVHC: Unknown; Military Standard: Not; Lead Free: Lead Free; RoHS Compliant: Yes; ComponentLink1URL: https://datasheet.ciiva.com/11808/0900766b8106beab-11808151.pdf?src-supplier=RSComponents; ComponentLink1Description: https://datasheet.ciiva.com/11808/0900766b8106beab-11808151.pdf?src-supplier=RSComponents; ComponentLink2URL: https://datasheet.ciiva.com/12669/rc0805-12669688.pdf?src-supplier=Mouser; ComponentLink2Description: https://datasheet.ciiva.com/12669/rc0805-12669688.pdf?src-supplier=Mouser; ComponentLink3URL: https://datasheet.ciiva.com/2456/pyu-r-int-thick-7-2456974.pdf?src-supplier=Digi-Key; ComponentLink3Description: https://datasheet.ciiva.com/2456/pyu-r-int-thick-7-2456974.pdf?src-supplier=Digi-Key; ComponentLink4URL: https://datasheet.ciiva.com/2456/pyu-r-int-thick-7-2456972.pdf?src-supplier=Digi-Key; ComponentLink4Description: https://datasheet.ciiva.com/2456/pyu-r-int-thick-7-2456972.pdf?src-supplier=Digi-Key; ComponentLink5URL: https://datasheet.ciiva.com/2456/pyu-r-int-thick-7-2456973.pdf?src-supplier=Digi-Key; ComponentLink5Description: https://datasheet.ciiva.com/2456/pyu-r-int-thick-7-2456973.pdf?src-supplier=Digi-Key; ComponentLink6URL: https://datasheet.ciiva.com/16747/rc0805-16747087.pdf?src-supplier=Future+Electronics; ComponentLink6Description: https://datasheet.ciiva.com/16747/rc0805-16747087.pdf?src-supplier=Future+Electronics; ComponentLink7URL: https://datasheet.ciiva.com/46447/444164-46447563.pdf?src-supplier=Element14; ComponentLink7Description: https://datasheet.ciiva.com/46447/444164-46447563.pdf?src-supplier=Element14
R2 R11 R12 R14 R21 R22 R26 = RC0805FR-0722RL: Res SMD 0805 22R 1% 0.125W T.C.100PPM; Manufacturer: Yageo; Temperature Coefficient: 100ppm/°C; Power Rating: 125mW; Voltage Rating: 150V; Supplier 1: Digi-Key; Supplier Part Number 1: 311-22.0CRCT-ND; Manufacturer Part Number: RC0805FR-0722RL; RoHS: Yes; Category: Chip SMD Resistors; Stock 1: 221158; Pricing 1: 1=0.10000, 10=0.04200, 100=0.01690, 1000=0.00759, 2500=0.00659 (USD); Case/Package: 0805; Case Code (Metric): 2012; Case Code (Imperial): 0805; Min Operating Temperature: -55°C; Max Operating Temperature: 155°C; Resistor Type: Thick Film; Resistance: 22R; Tolerance: 1%; Packaging: Tape and Reel; Package Quantity: 1; Number of Terminations: 2; Termination: SMD/SMT; Max Power Dissipation: 125mW; Working Voltage: 150V; Features: Moisture Resistant; Series: RC; Resistance Tolerance: 1%; Construction: Rectangular; Technology: THICK FILM; Length: 0.079inch; Width: 0.049inch; Height: 0.024inch; Depth: 1.25mm; RoHS Compliant: Yes; REACH SVHC: Unknown; Military Standard: Not; Lead Free: Lead Free; ComponentLink1URL: https://datasheet.ciiva.com/11819/0900766b8106beab-11819837.pdf?src-supplier=RSComponents; ComponentLink1Description: https://datasheet.ciiva.com/11819/0900766b8106beab-11819837.pdf?src-supplier=RSComponents; ComponentLink2URL: https://datasheet.ciiva.com/46447/444164-46447574.pdf?src-supplier=Element14; ComponentLink2Description: https://datasheet.ciiva.com/46447/444164-46447574.pdf?src-supplier=Element14; ComponentLink3URL: https://datasheet.ciiva.com/2457/pyu-r-int-thick-7-2457045.pdf?src-supplier=Digi-Key; ComponentLink3Description: https://datasheet.ciiva.com/2457/pyu-r-int-thick-7-2457045.pdf?src-supplier=Digi-Key; ComponentLink4URL: https://datasheet.ciiva.com/2457/pyu-r-int-thick-7-2457046.pdf?src-supplier=Digi-Key; ComponentLink4Description: https://datasheet.ciiva.com/2457/pyu-r-int-thick-7-2457046.pdf?src-supplier=Digi-Key; ComponentLink5URL: https://datasheet.ciiva.com/2457/pyu-r-int-thick-7-2457044.pdf?src-supplier=Digi-Key; ComponentLink5Description: https://datasheet.ciiva.com/2457/pyu-r-int-thick-7-2457044.pdf?src-supplier=Digi-Key; ComponentLink6URL: https://datasheet.ciiva.com/12667/rc0805-12667371.pdf?src-supplier=Mouser; ComponentLink6Description: https://datasheet.ciiva.com/12667/rc0805-12667371.pdf?src-supplier=Mouser